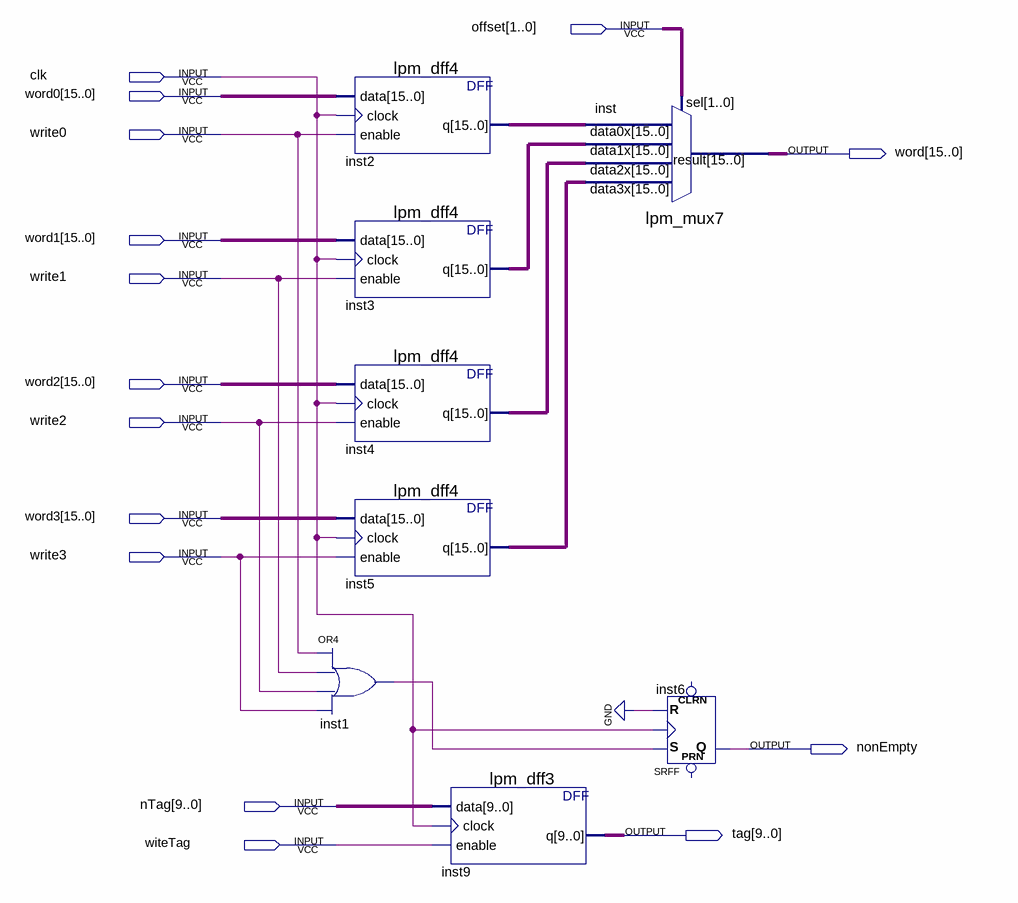
[diagram p0: schematic sheet]
// Quartus schematic cache_row.bdf as structural Verilog: 8 symbols, 15 pins
module cache_row (
  input  [1:0] offset,
  input  clk,
  input  [15:0] word0,
  input  write0,
  input  [15:0] word1,
  input  write1,
  input  [15:0] word2,
  input  write2,
  input  [15:0] word3,
  input  write3,
  input  [9:0] nTag,
  input  witeTag,
  output [15:0] word,
  output nonEmpty,
  output [9:0] tag
);

  wire inst1_out;
  wire [15:0] inst2_q, inst3_q, inst4_q, inst5_q;

  lpm_dff4 inst2 (.data(word0), .clock(clk), .enable(write0), .q(inst2_q));
  lpm_dff4 inst3 (.data(word1), .clock(clk), .enable(write1), .q(inst3_q));
  lpm_dff4 inst4 (.data(word2), .clock(clk), .enable(write2), .q(inst4_q));
  lpm_dff4 inst5 (.data(word3), .clock(clk), .enable(write3), .q(inst5_q));
  or inst1 (inst1_out, write0, write1, write2, write3);
  lpm_dff3 inst9 (.data(nTag), .clock(clk), .enable(witeTag), .q(tag));
  lpm_mux7 inst (.data3x(inst5_q), .data2x(inst4_q), .data1x(inst3_q), .data0x(inst2_q), .sel(offset), .result(word));
  SRFF inst6 (.S(inst1_out), .R(1'b0), .CLK(clk), .Q(nonEmpty));  // open: PRN, CLRN
endmodule
